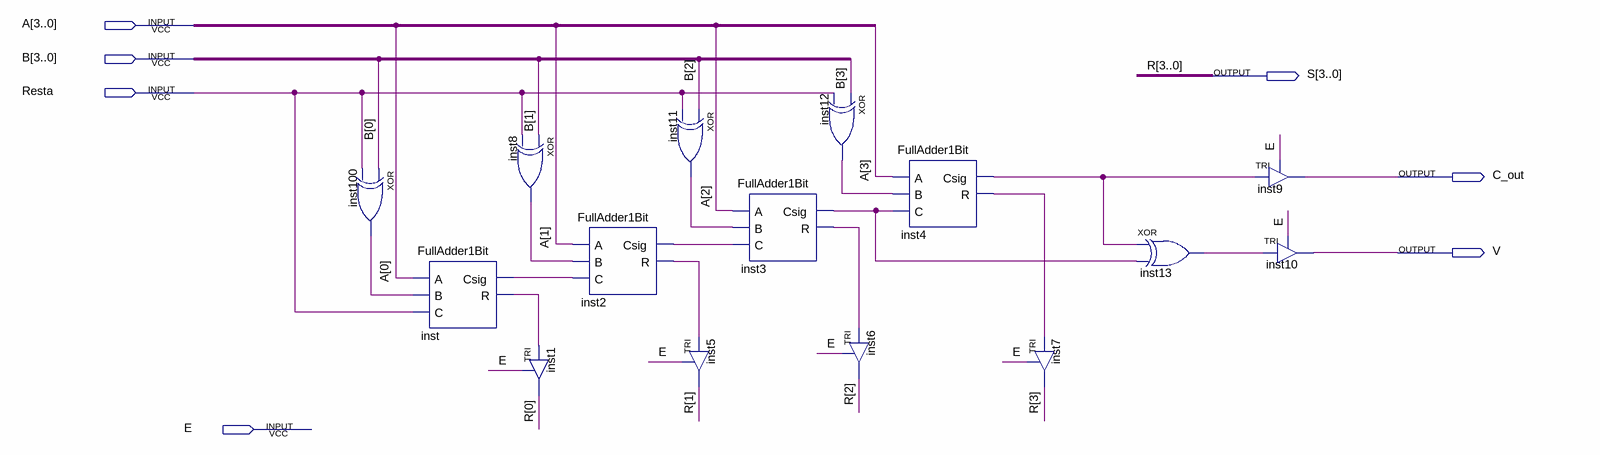
[diagram p0: schematic sheet]
// Quartus schematic SumaResta.bdf as structural Verilog: 15 symbols, 7 pins
module SumaResta (
  input  [3:0] A,
  input  [3:0] B,
  input  Resta,
  input  E,
  output [3:0] S,
  output C_out,
  output V
);

  wire inst2_csig, inst2_r, inst3_csig, inst3_r, inst4_csig, inst4_r, inst8_out, inst11_out, inst12_out,
       inst13_out, inst100_out, inst_csig, inst_r;

  xor inst100 (inst100_out, B[0], Resta);
  FullAdder1Bit inst (.A(A[0]), .B(inst100_out), .C(Resta), .Csig(inst_csig), .R(inst_r));
  xor inst8 (inst8_out, B[1], Resta);
  TRI inst1 (.IN(inst_r), .OE(E), .OUT(S[0]));
  FullAdder1Bit inst2 (.A(A[1]), .B(inst8_out), .C(inst_csig), .Csig(inst2_csig), .R(inst2_r));
  xor inst11 (inst11_out, B[2], Resta);
  TRI inst5 (.IN(inst2_r), .OE(E), .OUT(S[1]));
  FullAdder1Bit inst3 (.A(A[2]), .B(inst11_out), .C(inst2_csig), .Csig(inst3_csig), .R(inst3_r));
  xor inst12 (inst12_out, B[3], Resta);
  FullAdder1Bit inst4 (.A(A[3]), .B(inst12_out), .C(inst3_csig), .Csig(inst4_csig), .R(inst4_r));
  TRI inst6 (.IN(inst3_r), .OE(E), .OUT(S[2]));
  TRI inst7 (.IN(inst4_r), .OE(E), .OUT(S[3]));
  xor inst13 (inst13_out, inst4_csig, inst3_csig);
  TRI inst9 (.IN(inst4_csig), .OE(E), .OUT(C_out));
  TRI inst10 (.IN(inst13_out), .OE(E), .OUT(V));

  // Other names for the same wires on the sheet: R[3:0] = S
endmodule
